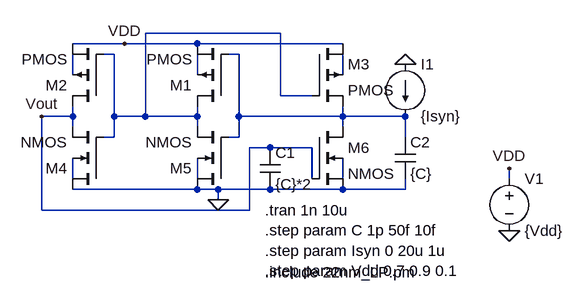
[diagram p0: schematic sourikopoulos.asc]
sourikopoulos.asc, the LTspice schematic file:
Version 4
SHEET 1 980 680
WIRE 512 208 304 208
WIRE 272 224 192 224
WIRE 384 224 272 224
WIRE 608 224 384 224
WIRE 256 240 240 240
WIRE 448 240 432 240
WIRE 192 272 192 240
WIRE 384 272 384 240
WIRE 608 272 608 240
WIRE 512 304 512 208
WIRE 560 304 512 304
WIRE 192 336 192 320
WIRE 192 336 144 336
WIRE 256 336 256 240
WIRE 304 336 304 208
WIRE 304 336 256 336
WIRE 384 336 384 320
WIRE 384 336 304 336
WIRE 448 336 448 240
WIRE 608 336 608 320
WIRE 608 336 448 336
WIRE 704 336 608 336
WIRE 192 352 192 336
WIRE 384 352 384 336
WIRE 608 352 608 336
WIRE 256 368 256 336
WIRE 256 368 240 368
WIRE 448 368 448 336
WIRE 448 368 432 368
WIRE 704 368 704 336
WIRE 496 384 464 384
WIRE 560 384 496 384
WIRE 192 432 192 400
WIRE 384 432 384 400
WIRE 560 432 560 384
WIRE 608 432 608 400
WIRE 864 432 864 416
WIRE 384 448 192 448
WIRE 416 448 384 448
WIRE 496 448 416 448
WIRE 608 448 496 448
WIRE 704 448 704 432
WIRE 704 448 608 448
WIRE 416 464 416 448
WIRE 144 480 144 336
WIRE 464 480 464 384
WIRE 464 480 144 480
FLAG 864 416 VDD
FLAG 864 512 0
FLAG 272 224 VDD
FLAG 416 464 0
FLAG 704 256 0
FLAG 144 336 Vout
SYMBOL pmos4 432 320 R180
SYMATTR InstName M1
SYMATTR Value2 l=22n w=101n
SYMBOL pmos4 240 320 R180
SYMATTR InstName M2
SYMATTR Value2 l=22n w=121n
SYMBOL pmos4 560 224 R0
SYMATTR InstName M3
SYMATTR Value2 l=22n w=134n
SYMBOL nmos4 240 448 R180
SYMATTR InstName M4
SYMATTR Value2 l=22n w=40n
SYMBOL nmos4 432 448 R180
SYMATTR InstName M5
SYMATTR Value2 l=22n w=195n
SYMBOL nmos4 560 352 R0
SYMATTR InstName M6
SYMATTR Value2 l=22n w=403n
SYMBOL Cap 480 384 R0
SYMATTR InstName C1
SYMATTR Value {C}*2
SYMBOL Cap 688 368 R0
SYMATTR InstName C2
SYMATTR Value {C}
SYMBOL current 704 256 R0
WINDOW 123 0 0 Left 0
WINDOW 39 0 0 Left 0
SYMATTR InstName I1
SYMATTR Value {Isyn}
SYMBOL voltage 864 416 R0
WINDOW 123 0 0 Left 0
WINDOW 39 0 0 Left 0
SYMATTR InstName V1
SYMATTR Value {Vdd}
TEXT 488 480 Left 2 !.tran 1n 10u\n.step param C 1p 50f 10f\n.step param Isyn 0 20u 1u\n.step param Vdd 0.7 0.9 0.1
TEXT 488 576 Left 2 !.include 22nm_LP.pm

The netlist it stands for:
* sourikopoulos.asc
M1 N001 N002 VDD N004 PMOS l=22n w=101n
M2 Vout N001 VDD N003 PMOS l=22n w=121n
M3 VDD N001 N002 N005 PMOS l=22n w=134n
M4 0 N001 Vout N006 NMOS l=22n w=40n
M5 0 N002 N001 N007 NMOS l=22n w=195n
M6 N002 Vout 0 N008 NMOS l=22n w=403n
C1 Vout 0 {C}*2
C2 N002 0 {C}
I1 0 N002 {Isyn}
V1 VDD 0 {Vdd}
.model NMOS NMOS
.model PMOS PMOS
.lib standard.mos
.tran 1n 10u
.step param C 1p 50f 10f
.step param Isyn 0 20u 1u
.step param Vdd 0.7 0.9 0.1
.include 22nm_LP.pm
.backanno
.end